# Altium schematic sheet AMP2.SchDoc
size A; SheetNumber: 5; SheetTotal: 6
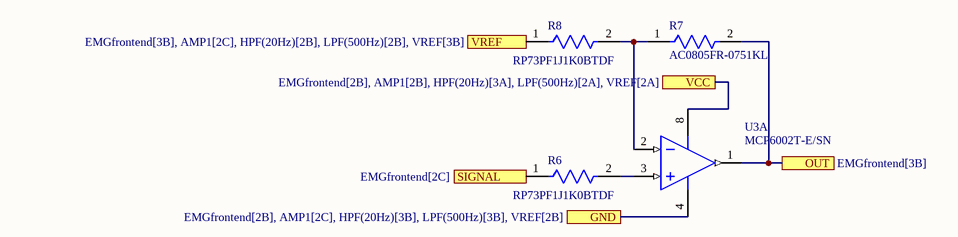
[diagram p0: AMP2.SchDoc]

## Parts
R6  RP73PF1J1K0BTDF  [FP-RP73P-1J-MFG]
R7  AC0805FR-0751KL  [FP-AC0805-MFG]
R8  RP73PF1J1K0BTDF  [FP-RP73P-1J-MFG]
U3  MCP6002T-E/SN  [SOIC-SN8_N]  (part A of 2)

## Ports
GND (see EMGfrontend[2B], AMP1[2C], HPF(20Hz)[3B], LPF(500Hz)[3B], VREF[2B]), OUT (see EMGfrontend[3B]), SIGNAL (see EMGfrontend[2C]), VCC (see EMGfrontend[2B], AMP1[2B], HPF(20Hz)[3A], LPF(500Hz)[2A], VREF[2A]), VREF (see EMGfrontend[3B], AMP1[2C], HPF(20Hz)[2B], LPF(500Hz)[2B], VREF[3B])

## Nets
GND: U3.4(VSS) ; port GND
OUT: R7.2 U3.1(VOUTA) ; port OUT
SIGNAL: R6.1 ; port SIGNAL
VCC: U3.8(VDD) ; port VCC
VREF: R8.1 ; port VREF
NetR6_2: R6.2 U3.3(VINA+)
NetR7_1: R7.1 R8.2 U3.2(VINA-)

## Library data of the parts
R6 R8 = CMP-03211-004517-1: RES SMD 1K OHM 0.1% 1/6W 0603; Manufacturer: TE Connectivity; Value: 1KΩ; Power Rating: 0.166W; Tolerance: 0.001; Temperature Coefficient: 25ppm/°C; Description: RP73P 0603 1KΩ 0.166W 25ppm/°C 0.10% 100V; Voltage Rating: 100V; Composition: Thin Film; Category: Res; Temperature Range High: +155°C; Device Class L1: Passive Components; Digikey Description: RES SMD 1K OHM 0.1% 1/6W 0603; Lead Free: Yes; RoHS: TRUE; Ipc Land Pattern Name: RESC15580X45; Automotive: No; Temperature: -55°C to +155°C; Height: 0.55mm; ComponentLink2URL: https://www.te.com/commerce/DocumentDelivery/DDEController?Action=srchrtrv&DocNm=1773272&DocType=DS&DocLang=English; Manufacturer Part Number: RP73PF1J1K0BTDF; Resistance: 1KΩ; ComponentLink2Description: Datasheet; Temperature Range Low: -55°C; Octopart: https://octopart.com/rp73pf1j1k0btdf-te+connectivity-45465729; Device Class L3: Chip SMD Resistors; Series: RP73P; Package: RP73P-1J; Device Class L2: Resistors
R7 = CMP-03412-037324-1: RES SMD 51K OHM 1% 1/8W 0805; Manufacturer: Yageo; Voltage Rating: 150V; Automotive Grade: Grade 0; Resistance: 51KΩ; Tolerance: 0.01; Value: 51KΩ; Device Class L3: Chip SMD Resistors; Category: Res; Composition: Thick Film; Device Class L1: Passive Components; ComponentLink2Description: Datasheet; Manufacturer Part Number: AC0805FR-0751KL; Temperature: -55°C to +155°C; Height: 0.6mm; Package: AC0805; ComponentLink2URL: http://www.yageo.com/documents/recent/PYu-AC_51_RoHS_L_6.pdf; Mouser Description: Thick Film Resistors - SMD 1/8W 51K ohm 1%; Lead Free: Yes; Digikey Description: RES SMD 51K OHM 1% 1/8W 0805; RoHS: TRUE; Device Class L2: Resistors; Octopart: https://octopart.com/ac0805fr-0751kl-yageo-24874955; Ipc Land Pattern Name: RESC200125X50; Temperature Range Low: -55°C; Footprint Url: http://www.yageo.com/exep/pages/download/literatures/PYu-R_Mount_10.pdf; Series: AC; Automotive: Yes; Power Rating: 1/8W; Temperature Range High: +155°C
U3 = CMP-0187-00363-3: None; Nominal Supply Current: 100uA; Operating Supply Voltage: 5.5V; Input Bias Current: 1pA; Output Current per Channel: 23mA; Unity Gain Bandwidth Product: 1MHz; Number of Elements: 2; Power Supply Rejection Ratio (PSRR): 86dB; Slew Rate: 0.6V/µs; Min Supply Voltage: 1.8V; Voltage Gain: 112dB; Max Supply Voltage: 6V; Input Offset Voltage (Vos): 4.5mV; Common Mode Rejection Ratio: 60dB; Amplifier Type: GENERAL PURPOSE; Technology: CMOS; Output Current: 23mA; Number of Pins: 8; Lead Free: Lead Free; Number of Channels: 2; Package Quantity: 3300; Max Operating Temperature: 125°C; Number of Circuits: 2; Supply Current: 100uA; Gain Bandwidth Product: 1MHz; Min Operating Temperature: -40°C; Series: -; Mount: Surface Mount; Case/Package: SOIC; Radiation Hardening: No; Packaging: Tape and Reel; Operating Supply Current: 100uA; RoHS Compliant: Yes